# Altium schematic sheet Elekid.SchDoc
size A4
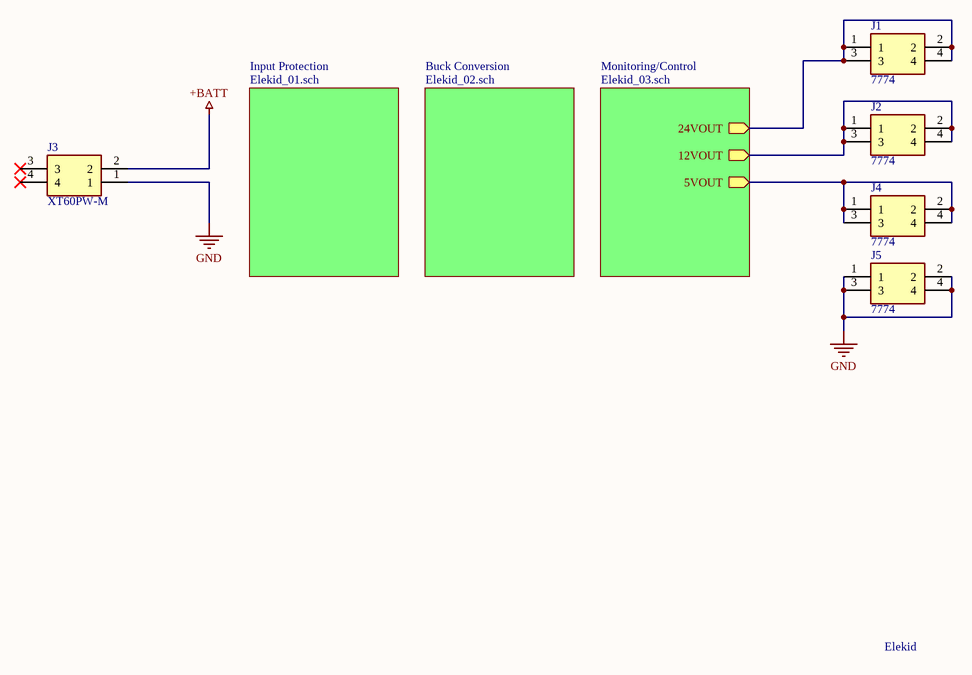
[diagram p0: Elekid.SchDoc]

## Parts
J1  7774  [7774]
J2  7774  [7774]
J3  XT60PW-M  [XT60PWM]
J4  7774  [7774]
J5  7774  [7774]

## Sub-sheets
Buck Conversion = Elekid_02.sch: no entries
Input Protection = Elekid_01.sch: no entries
Monitoring/Control = Elekid_03.sch: 24VOUT (out), 12VOUT (out), 5VOUT (out)

## Nets
+BATT: J3.2
GND: J3.1 J5.1 J5.2 J5.3 J5.4
NetJ1_1: J1.1 J1.2 J1.3 J1.4 ; sheet Monitoring/Control/24VOUT
NetJ2_1: J2.1 J2.2 J2.3 J2.4 ; sheet Monitoring/Control/12VOUT
NetJ4_1: J4.1 J4.2 J4.3 J4.4 ; sheet Monitoring/Control/5VOUT

Not connected (* = marked no-connect by the designer): J3 3* 4*

## Notes on the sheet
- Elekid

## Library data of the parts
J1 J2 J4 J5 = 7774: Connector; Manufacturer_Name: Keystone Electronics; Datasheet Link: http://keyelco.com/userAssets/file/M65p66.pdf; Height: 4.6mm; Manufacturer_Part_Number: 7774; Arrow Part Number: 7774; Mouser Part Number: 534-7774; Mouser Price/Stock: https://www.mouser.co.uk/ProductDetail/Keystone-Electronics/7774?qs=%252B%252BPv0l39JAFc7pxogUYqRg%3D%3D
J3 = XT60PW-M: Connector; Manufacturer_Name: Changzou Amass Elec; Datasheet Link: https://www.tme.eu/Document/9b8d0c5eb7094295f3d3112c214d3ade/XT60PW%20SPEC.pdf; Height: 8.4mm; Manufacturer_Part_Number: XT60PW-M; Arrow Part Number: XT60PW-M